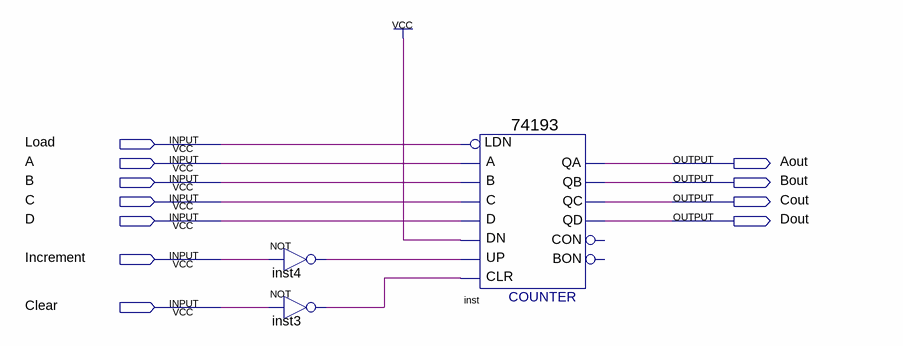
[diagram p0: schematic sheet]
// Quartus schematic Program_Counter.bdf as structural Verilog: 3 symbols, 11 pins
module Program_Counter (
  input  Load,
  input  A,
  input  B,
  input  C,
  input  D,
  input  Increment,
  input  Clear,
  output Aout,
  output Bout,
  output Cout,
  output Dout
);

  wire inst3_out, inst4_out;

  not inst4 (inst4_out, Increment);
  not inst3 (inst3_out, Clear);
  \74193  inst (
    .D(D), .C(C), .B(B), .A(A), .CLR(inst3_out), .UP(inst4_out), .DN(1'b1), .LDN(Load), .QB(Bout), .QA(Aout),
    .QD(Dout), .QC(Cout));  // open: CON, BON
endmodule
